# EAGLE design main_v1 (EAGLE 6.5.0)
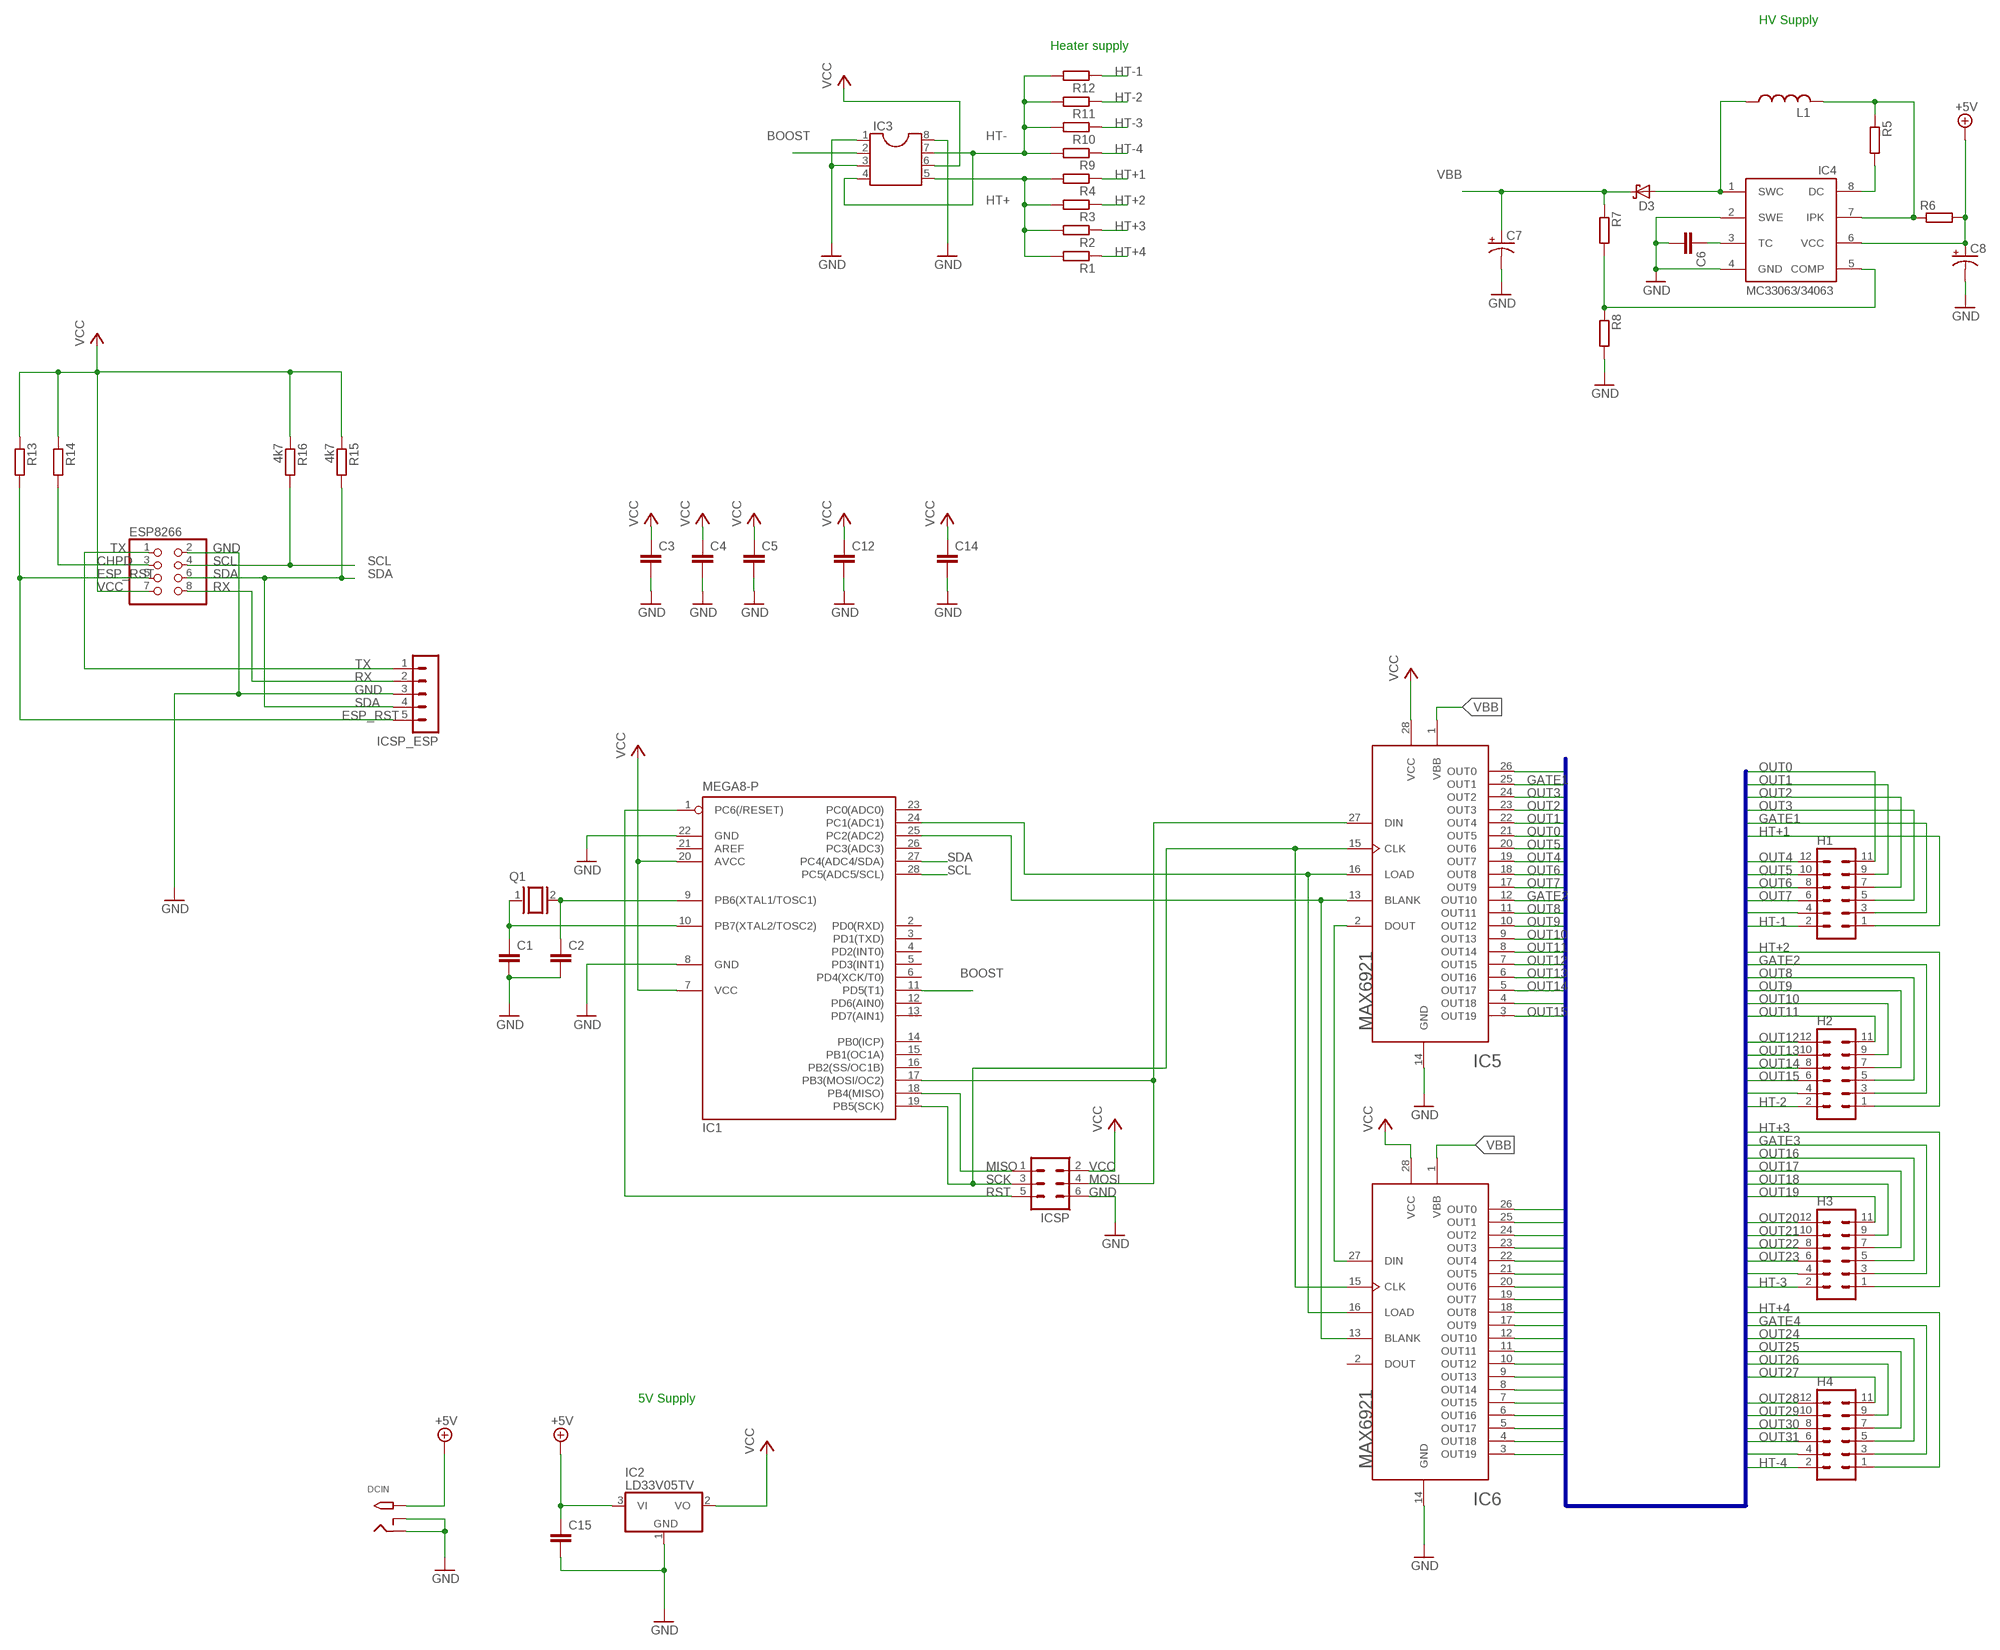
[diagram p0: schematic, sheet 1]

## Parts
C1  C2.5/2  [C2.5-2]
C2  C2.5/2  [C2.5-2]
C3  C-EU025-025X050  [C025-025X050]
C4  C-EU025-025X050  [C025-025X050]
C5  C-EU025-025X050  [C025-025X050]
C6  C-EU025-025X050  [C025-025X050]
C7  CPOL-USE3.5-8  [E3,5-8]
C8  CPOL-USE2.5-5  [E2,5-5]
C12  C-EU025-025X050  [C025-025X050]
C14  C-EU025-025X050  [C025-025X050]
C15  C-EU025-025X050  [C025-025X050]
D3  SCHOTTKY-DIODEDO35-7  [DO35-7]
DCIN  2.1MMJACKTHM  [PJ-102A]
ESP8266  PINHD-2X4  [2X04]
H1  MA06-2  [MA06-2]
H2  MA06-2  [MA06-2]
H3  MA06-2  [MA06-2]
H4  MA06-2  [MA06-2]
IC1  MEGA8-P  [DIL28-3]
IC2  LD33V05TV  [TO220V]
IC3  DIL8  [DIL08]
IC4  MC33063/MC34063P  [DIL08]
IC5  MAX6921  [PLCC-S28]
IC6  MAX6921  [PLCC-S28]
ICSP  MA03-2  [MA03-2]
ICSP_ESP  MA05-1  [MA05-1]
L1  L-US6000-XXX-RC  [6000-XXXX-RC]
Q1  XTAL/S  [QS]
R1  R-EU_0204/7  [0204/7]
R2  R-EU_0204/7  [0204/7]
R3  R-EU_0204/7  [0204/7]
R4  R-EU_0204/7  [0204/7]
R5  R-EU_0204/7  [0204/7]
R6  R-EU_0204/7  [0204/7]
R7  R-EU_0204/7  [0204/7]
R8  R-EU_0204/7  [0204/7]
R9  R-EU_0204/7  [0204/7]
R10  R-EU_0204/7  [0204/7]
R11  R-EU_0204/7  [0204/7]
R12  R-EU_0204/7  [0204/7]
R13  R-EU_0207/10  [0207/10]
R14  R-EU_0204/7  [0204/7]
R15  4k7  R-EU_0204/7  [0204/7]
R16  4k7  R-EU_0204/7  [0204/7]

## Nets
+5V: C8.+ C15.1 DCIN.TIP IC2.3(VI) IC4.6(VCC) R6.2
BOOST: IC1.11(PD5(T1)) IC3.2
CHPD: ESP8266.3 R14.2
ESP_RST: ESP8266.5 ICSP_ESP.5 R13.2
GATE1: H1.3 IC5.25(OUT1)
GATE2: H2.3 IC5.12(OUT10)
GATE3: H3.3 IC6.25(OUT1)
GATE4: H4.3 IC6.12(OUT10)
GND: C1.2 C2.2 C3.2 C4.2 C5.2 C6.2 C7.- C8.- C12.2 C14.2 C15.2 DCIN.RING DCIN.RING_SW ESP8266.2 IC1.8(GND) IC1.22(GND) IC2.1(GND) IC3.1 IC3.3 IC3.8 IC4.2(SWE) IC4.4(GND) IC5.14(GND) IC6.14(GND) ICSP.6 ICSP_ESP.3 R8.2
HT+: IC3.5 R1.2 R2.2 R3.2 R4.2
HT+1: H1.1 R4.1
HT+2: H2.1 R3.1
HT+3: H3.1 R2.1
HT+4: H4.1 R1.1
HT-: IC3.4 IC3.7 R9.2 R10.2 R11.2 R12.2
HT-1: H1.2 R12.1
HT-2: H2.2 R11.1
HT-3: H3.2 R10.1
HT-4: H4.2 R9.1
MISO: IC1.18(PB4(MISO)) ICSP.1
MOSI: IC1.17(PB3(MOSI/OC2)) IC5.27(DIN) ICSP.4
N$1: IC5.2(DOUT) IC6.27(DIN)
N$2: C1.1 IC1.10(PB7(XTAL2/TOSC2)) Q1.1
N$3: IC1.25(PC2(ADC2)) IC5.13(BLANK) IC6.13(BLANK)
N$4: IC1.24(PC1(ADC1)) IC5.16(LOAD) IC6.16(LOAD)
N$5: C6.1 IC4.3(TC)
N$6: C2.1 IC1.9(PB6(XTAL1/TOSC1)) Q1.2
N$7: D3.A IC4.1(SWC) L1.1
N$8: IC4.7(IPK) L1.2 R5.1 R6.1
N$9: IC4.8(DC) R5.2
N$11: IC4.5(COMP) R7.2 R8.1
OUT0: H1.11 IC5.21(OUT5)
OUT1: H1.9 IC5.22(OUT4)
OUT2: H1.7 IC5.23(OUT3)
OUT3: H1.5 IC5.24(OUT2)
OUT4: H1.12 IC5.19(OUT7)
OUT5: H1.10 IC5.20(OUT6)
OUT6: H1.8 IC5.18(OUT8)
OUT7: H1.6 IC5.17(OUT9)
OUT8: H2.5 IC5.11(OUT11)
OUT9: H2.7 IC5.10(OUT12)
OUT10: H2.9 IC5.9(OUT13)
OUT11: H2.11 IC5.8(OUT14)
OUT12: H2.12 IC5.7(OUT15)
OUT13: H2.10 IC5.6(OUT16)
OUT14: H2.8 IC5.5(OUT17)
OUT15: H2.6 IC5.3(OUT19)
OUT16: H3.5 IC6.24(OUT2)
OUT17: H3.7 IC6.23(OUT3)
OUT18: H3.9 IC6.22(OUT4)
OUT19: H3.11 IC6.21(OUT5)
OUT20: H3.12 IC6.19(OUT7)
OUT21: H3.10 IC6.20(OUT6)
OUT22: H3.8 IC6.18(OUT8)
OUT23: H3.6 IC6.17(OUT9)
OUT24: H4.5 IC6.11(OUT11)
OUT25: H4.7 IC6.10(OUT12)
OUT26: H4.9 IC6.9(OUT13)
OUT27: H4.11 IC6.8(OUT14)
OUT28: H4.12 IC6.7(OUT15)
OUT29: H4.10 IC6.6(OUT16)
OUT30: H4.8 IC6.5(OUT17)
OUT31: H4.6 IC6.3(OUT19)
RST: IC1.1(PC6(/RESET)) ICSP.5
RX: ESP8266.8 ICSP_ESP.2
SCK: IC1.19(PB5(SCK)) IC5.15(CLK) IC6.15(CLK) ICSP.3
SCL: ESP8266.4 IC1.28(PC5(ADC5/SCL)) R16.2
SDA: ESP8266.6 IC1.27(PC4(ADC4/SDA)) ICSP_ESP.4 R15.2
SPARE1: H1.4 IC5.26(OUT0)
SPARE2: H2.4 IC5.4(OUT18)
SPARE3: H3.4 IC6.26(OUT0)
SPARE4: H4.4 IC6.4(OUT18)
TX: ESP8266.1 ICSP_ESP.1
VBB: C7.+ D3.C IC5.1(VBB) IC6.1(VBB) R7.1
VCC: C3.1 C4.1 C5.1 C12.1 C14.1 ESP8266.7 IC1.7(VCC) IC1.20(AVCC) IC2.2(VO) IC3.6 IC5.28(VCC) IC6.28(VCC) ICSP.2 R13.1 R14.1 R15.1 R16.1
Unconnected: IC1.2(PD0(RXD)) IC1.3(PD1(TXD)) IC1.4(PD2(INT0)) IC1.5(PD3(INT1)) IC1.6(PD4(XCK/T0)) IC1.12(PD6(AIN0)) IC1.13(PD7(AIN1)) IC1.14(PB0(ICP)) IC1.15(PB1(OC1A)) IC1.16(PB2(SS/OC1B)) IC1.21(AREF) IC1.23(PC0(ADC0)) IC1.26(PC3(ADC3)) IC6.2(DOUT)

## Buses
OUT[0..32],HT+[1..4],HT-[1..4],GATE[1..4],SPARE[1..4]

## Notes on the sheet
- HV Supply
- Heater supply
- 5V Supply

## Library data of the parts
C1 C2 = capacitor-wima:C: CAPACITOR naming: grid - package width
C3-C6 C12 C14 C15 = resistor:C-EU: CAPACITOR, European symbol
C7 C8 = adafruit:CPOL-US: POLARIZED CAPACITOR, American symbol
D3 = adafruit:SCHOTTKY-DIODE: Schottky Diode
DCIN = adafruit:2.1MMJACK: 2.1mm x 5.5mm THM DC jack with internal switch. Digikey part #PJ-102A, 4UCON part #05537 2.1mm x 5.5mm SMT DC jack with internal switch. Digikey part #PJ-002A-SMT, 4UCON part #03267 By microbuilder.eu & adafruit.com
ESP8266 = adafruit:PINHD-2X4: PIN HEADER
H1-H4 = con-lstb:MA06-2: PIN HEADER; OC_FARNELL: unknown; OC_NEWARK: unknown
IC1 = atmel:MEGA8-P: MICROCONTROLLER 8 Kbytes FLASH, 1 kbytes SRAM, 512 bytes EEPROM, USART, 4-channel 10 bit ADC, 2-channel 8 bit ADC Pin compatible with Atmega48, ATMega88, ATMega168 Source: avr.lbr; OC_FARNELL: unknown; OC_NEWARK: unknown
IC2 = ld33v:LD33V: Positive VOLTAGE REGULATOR Source: http://cache.national.com/ds/LM/LM78L05.pdf http://www.fairchildsemi.com/ds/LM/LM7805.pdf
IC3 = ic-package:DIL8: Dual In Line / Socket
IC4 = adafruit:MC33063/MC34063: MC33063 and MC34063 Basic DC/DC converter with internal power-NPN transistor, 100KHz, 1.5A peak switch current. 3-40 input/output.
IC5 IC6 = adafruit:MAX6921: MAX6921 76V VFD driver in TSSOP and PLCC. Can be cascaded, talk to it via SPI
ICSP = con-lstb:MA03-2: PIN HEADER; OC_FARNELL: unknown; OC_NEWARK: unknown
ICSP_ESP = con-lstb:MA05-1: PIN HEADER; OC_FARNELL: unknown; OC_NEWARK: unknown
L1 = rcl:L-US: INDUCTOR, American symbol
Q1 = special:XTAL/S: CRYSTAL
R1-R16 = resistor:R-EU_: RESISTOR, European symbol

## Board
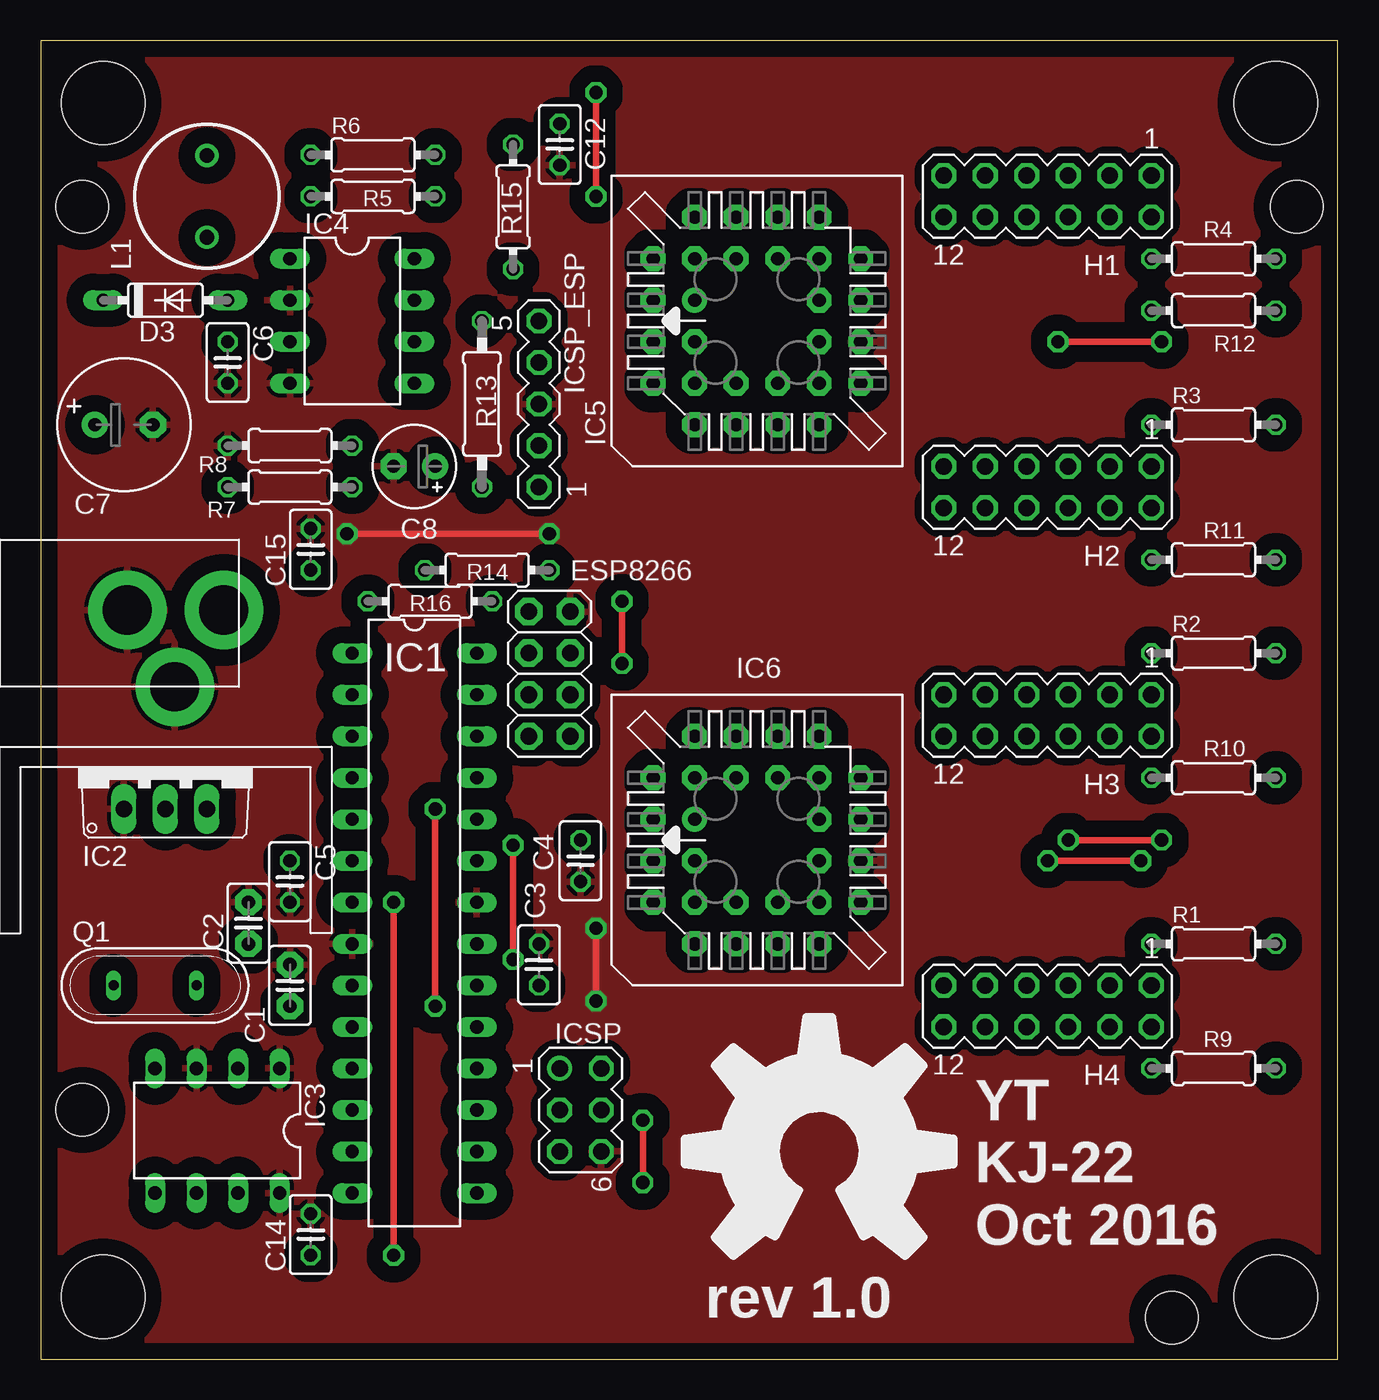
[diagram p1: board, top side]
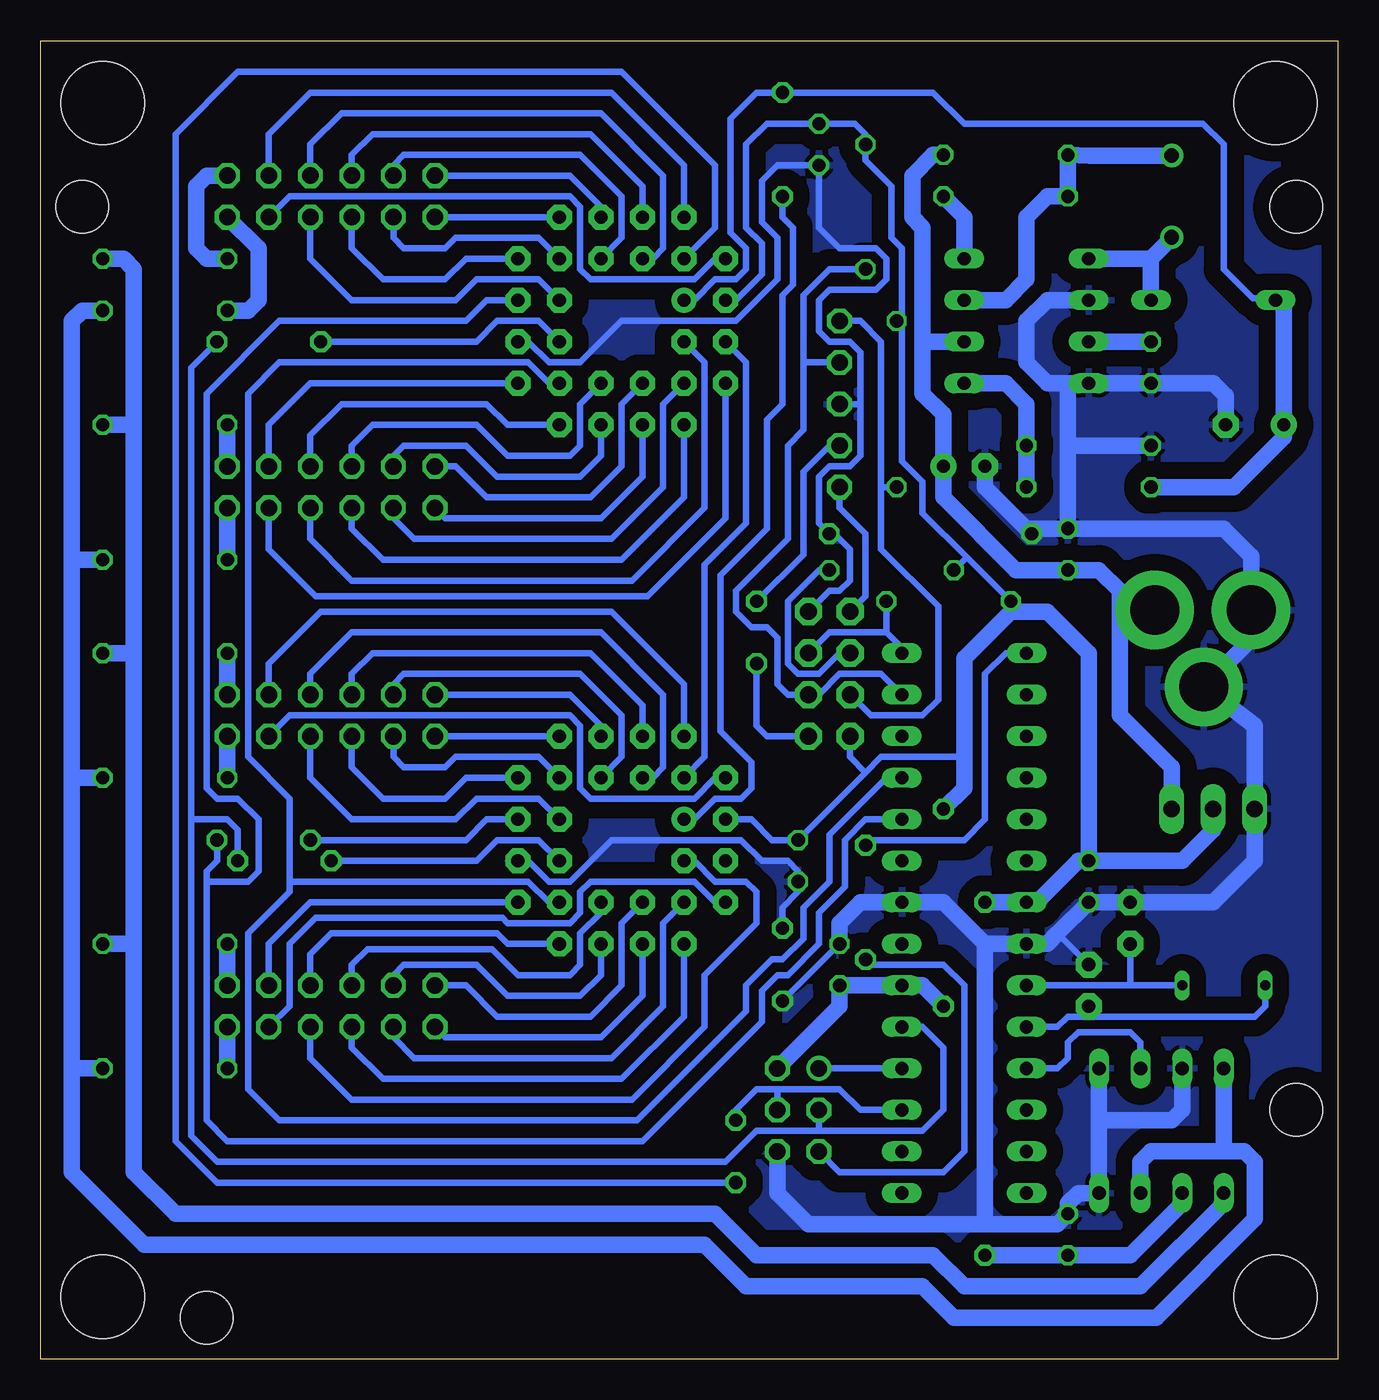
[diagram p2: board, bottom side, seen from below]

Size 79.35 x 80.63 mm. Coordinates in mm from the lower left corner, seen from the top.
Outline: 0,0 79.35,0 79.35,80.63 0,80.63 0,0
Copper layers (1*16): Top 0.035559375mm / dielectric 1.6mm / Bottom 0.035559375mm
Design rules "oshpark dru": minimum track width 6mil, minimum drill 10mil, track to track 6mil, track to pad 6mil, pad to pad 6mil, via to via 6mil, smd to smd 6mil, copper to edge 15mil, drill to drill 6mil, minimum pad ring 5mil, minimum via ring 5mil, stop-mask expansion 2.5mil, vias tented up to drill 0mil, thermal gap 10mil
Holes 5.08 mm at 3.81,76.83 3.81,3.81 75.56,3.81 75.56,76.83
Holes 3.2 mm at 2.54,70.48 2.54,15.24 69.21,2.54 76.83,70.48

### Footprints (pad centres in the part's own frame; a part is rotated, then mirrored left to right if it is on the bottom)
C2.5-2 = drill 0.813 pad 1.6 octagon: 1 -1.27,0; 2 1.27,0
C025-025X050 = drill 0.813 octagon: 1 -1.27,0; 2 1.27,0
E3,5-8 = drill 0.813 pad 1.6: + -1.778,0 | drill 0.813 pad 1.6 octagon: - 1.778,0
E2,5-5 = drill 0.813 pad 1.6: + -1.27,0 | drill 0.813 pad 1.6 octagon: - 1.27,0
DO35-7 = drill 0.813 long: A 3.81,0; C -3.81,0
PJ-102A = drill 3 pad 4.8: RING 0.1,-3.39; RING_SW -4.6,-6.29; TIP 0.1,-9.29
2X04 = drill 1.016 pad 1.676 octagon: 1 -3.81,-1.27; 2 -3.81,1.27; 3 -1.27,-1.27; 4 -1.27,1.27; 5 1.27,-1.27; 6 1.27,1.27; 7 3.81,-1.27; 8 3.81,1.27
MA06-2 = drill 1.016 octagon: 1 -6.35,-1.27; 2 -6.35,1.27; 3 -3.81,-1.27; 4 -3.81,1.27; 5 -1.27,-1.27; 6 -1.27,1.27; 7 1.27,-1.27; 8 1.27,1.27; 9 3.81,-1.27; 10 3.81,1.27; 11 6.35,-1.27; 12 6.35,1.27
DIL28-3 = drill 0.813 long: 1 -16.51,-3.81; 2 -13.97,-3.81; 3 -11.43,-3.81; 4 -8.89,-3.81; 5 -6.35,-3.81; 6 -3.81,-3.81; 7 -1.27,-3.81; 8 1.27,-3.81; 9 3.81,-3.81; 10 6.35,-3.81; 11 8.89,-3.81; 12 11.43,-3.81; 13 13.97,-3.81; 14 16.51,-3.81; 15 16.51,3.81; 16 13.97,3.81; 17 11.43,3.81; 18 8.89,3.81; 19 6.35,3.81; 20 3.81,3.81; 21 1.27,3.81; 22 -1.27,3.81; 23 -3.81,3.81; 24 -6.35,3.81; 25 -8.89,3.81; 26 -11.43,3.81; 27 -13.97,3.81; 28 -16.51,3.81
TO220V = drill 1.016 long: 1 -2.54,-2.54; 2 0,-2.54; 3 2.54,-2.54
DIL08 = drill 0.813 long: 1 -3.81,-3.81; 2 -1.27,-3.81; 3 1.27,-3.81; 4 3.81,-3.81; 5 3.81,3.81; 6 1.27,3.81; 7 -1.27,3.81; 8 -3.81,3.81
PLCC-S28 = drill 0.813 pad 1.524: 1 1.27,3.81 | drill 0.813 pad 1.524 octagon: 2 -1.27,6.35; 3 -1.27,3.81; 4 -3.81,6.35; 5 -6.35,3.81; 6 -3.81,3.81; 7 -6.35,1.27; 8 -3.81,1.27; 9 -6.35,-1.27; 10 -3.81,-1.27; 11 -6.35,-3.81; 12 -3.81,-6.35; 13 -3.81,-3.81; 14 -1.27,-6.35; 15 -1.27,-3.81; 16 1.27,-6.35; 17 1.27,-3.81; 18 3.81,-6.35; 19 6.35,-3.81; 20 3.81,-3.81; 21 6.35,-1.27; 22 3.81,-1.27; 23 6.35,1.27; 24 3.81,1.27; 25 6.35,3.81; 26 3.81,6.35; 27 3.81,3.81; 28 1.27,6.35
MA03-2 = drill 1.016: 1 -2.54,-1.27 | drill 1.016 octagon: 2 -2.54,1.27; 3 0,-1.27; 4 0,1.27; 5 2.54,-1.27; 6 2.54,1.27
MA05-1 = drill 1.016 octagon: 1 -5.08,0; 2 -2.54,0; 3 0,0; 4 2.54,0; 5 5.08,0
6000-XXXX-RC = drill 0.9 pad 1.422: 1 -2.5,0; 2 2.5,0
QS = drill 0.61 long: 1 -2.54,0; 2 2.54,0
0204/7 = drill 0.813 octagon: 1 -3.81,0; 2 3.81,0
0207/10 = drill 0.813 octagon: 1 -5.08,0; 2 5.08,0

### Placement (x,y rotation side)
C1  15.24,22.86 90 top
C2  12.7,26.67 90 top
C3  30.48,24.13 90 top
C4  33.02,30.48 270 top
C5  15.24,29.21 270 top
C6  11.43,60.96 270 top
C7  5.08,57.15 0 top
C8  22.86,54.61 180 top
C12  31.75,74.3 270 top
C14  16.51,7.62 90 top
C15  16.51,49.53 90 top
D3  7.62,64.77 0 top
DCIN  1.91,45.72 90 top
ESP8266  31.12,41.91 270 top
H1  61.6,71.12 180 top
H2  61.6,53.34 180 top
H3  61.6,39.37 180 top
H4  61.6,21.59 180 top
IC1  22.86,26.67 270 top
IC2  7.62,36.2 0 top
IC3  10.8,13.97 180 top
IC4  19.05,63.5 270 top
IC5  43.81,63.5 90 top
IC6  43.81,31.75 90 top
ICSP  33.02,15.24 270 top
ICSP_ESP  30.48,58.42 90 top
L1  10.16,71.12 90 top
Q1  6.99,22.86 0 top
R1  71.75,25.4 0 top
R2  71.75,43.18 0 top
R3  71.75,57.15 0 top
R4  71.75,67.31 0 top
R5  20.32,71.12 0 top
R6  20.32,73.66 0 top
R7  15.24,53.34 0 top
R8  15.24,55.88 180 top
R9  71.75,17.78 0 top
R10  71.75,35.56 0 top
R11  71.75,48.9 0 top
R12  71.75,64.14 0 top
R13  26.99,58.42 270 top
R14  27.3,48.26 0 top
R15  28.89,70.48 270 top
R16  23.81,46.35 0 top

### Tracks (layer width: path | path; a pad name or v marks a point on that pad's centre or on a via)
+5V
  Bottom 1.016: R6.2 24.77,73.66 26.04,72.39 26.04,69.85 25.4,69.22 25.4,62.23 | 25.4,62.23 IC4.6 | 25.4,62.23 25.4,59.05 24.13,57.78 C8.+ 24.13,52.7 19.69,48.26 C15.1 14.61,48.26 13.34,46.99 13.34,45.72 | 13.34,45.72 13.34,39.37 10.16,36.2 IC2.3 | DCIN.TIP 13.23,45.82 13.34,45.72
BOOST
  Bottom 0.406: IC1.11 17.14,17.78 16.51,18.41 16.51,19.37 15.88,20 12.7,20 12.07,19.37 IC3.2
CHPD
  Bottom 0.406: ESP8266.3 30.48,43.18 31.75,41.91 33.02,41.91 33.66,42.55 33.66,46.35 31.75,48.26 R14.2
ESP_RST
  Bottom 0.406: ESP8266.5 28.57,39.37 25.4,39.37 24.45,40.32 24.45,46.04 27.94,49.53 27.94,53.34 | ICSP_ESP.5 29.21,63.5 27.94,62.23 27.94,53.34 | R13.2 27.94,53.34
GATE1
  Bottom 0.406: IC5.25 40.01,73.03 44.45,77.47 62.87,77.47 65.4,74.93 H1.3
GATE2
  Bottom 0.406: IC5.12 62.87,59.69 65.4,57.15 H2.3
GATE3
  Bottom 0.406: H3.3 65.4,42.55 62.23,45.72 44.45,45.72 40.01,41.27 IC6.25
GATE4
  Bottom 0.406: IC6.12 62.87,27.94 65.4,25.4 H4.3
GND  (via drill 0.81 pad 1.27)
  Top 0.406: v33.97,26.35 v33.97,21.91 | v18.73,50.48 v31.12,50.48
  Bottom 0.406: IC5.14 49.53,62.23 48.26,60.96 46.36,60.96 43.81,63.5 36.83,63.5 34.29,66.04 34.29,68.58 35.24,69.53 35.24,72.07 34.29,73.03 C12.2 31.75,69.22 30.48,67.94 28.26,67.94 27.62,67.31 27.62,66.04 28.26,65.41 31.12,65.41 31.75,64.77 31.75,62.87 31.12,62.23 29.84,62.23 29.21,61.59 29.21,58.42 | IC6.14 49.53,30.48 48.26,29.21 46.99,29.21 44.45,31.75 36.51,31.75 35.24,30.48 33.66,30.48 33.02,29.84 C4.2 33.02,28.57 33.97,27.62 v33.97,26.35 | C1.2 17.14,26.04 | C3.2 v33.97,21.91 | ESP8266.2 31.12,46.99 30.48,46.99 29.84,47.62 29.84,49.53 30.8,50.48 v31.12,50.48 31.75,51.12 31.75,53.98 31.12,54.61 29.84,54.61 29.21,55.24 29.21,58.42 | ICSP_ESP.3 29.21,58.42
  Bottom 1.016: 16.51,59.69 IC4.4 C6.2 7.62,59.69 6.86,58.93 C7.- | IC4.2 17.78,64.77 19.05,63.5 19.05,60.96 17.78,59.69 16.51,59.69 | 16.51,59.69 16.51,55.88 | C8.- 21.59,53.34 19.05,50.8 18.73,50.8 | R8.2 16.51,55.88 | 16.51,55.88 C15.2 | C15.2 18.73,50.8 | C15.2 6.99,50.8 5.29,49.11 DCIN.RING 5.29,44.02 DCIN.RING_SW 5.08,38.73 IC2.1 5.08,30.48 7.62,27.94 C2.2 C5.2 17.14,26.04 17.78,25.4 IC1.8 21.59,25.4 | C3.2 30.48,26.67 29.21,27.94 IC1.22 24.13,27.94 21.59,25.4 | ICSP.6 34.29,10.16 32.38,8.26 21.59,8.26 | 21.59,8.26 21.59,25.4 | 21.59,8.26 17.14,8.26 C14.2 16.51,9.53 15.88,10.16 IC3.8 14.61,14.61 | 14.61,14.61 10.16,14.61 9.52,15.24 IC3.3 | IC3.1 14.61,14.61 | v18.73,50.48 18.73,50.8
  pour Bottom (isolate 1.016): 0.63,0.64 78.74,0.64 78.74,80.01 0.63,80.01
  pour Top (isolate 1.016): 0.63,80.01 78.74,80.01 78.74,0.64 0.63,0.64
HT+
  Bottom 1.016: IC3.5 6.99,9.53 12.07,4.45 22.86,4.45 24.77,6.35 35.56,6.35 38.1,8.89 71.12,8.89 73.66,11.43 73.66,25.4 | 73.66,25.4 73.66,43.18 | 73.66,43.18 73.66,57.15 | 73.66,57.15 73.66,66.67 74.29,67.31 R4.2 | R3.2 73.66,57.15 | R2.2 73.66,43.18 | R1.2 73.66,25.4
HT+1
  Bottom 1.016: R4.1 69.21,67.31 69.85,67.94 69.85,71.75 69.21,72.39 H1.1
HT+2
  Bottom 1.016: H2.1 R3.1
HT+3
  Bottom 1.016: H3.1 R2.1
HT+4
  Bottom 1.016: R1.1 H4.1
HT-
  Bottom 1.016: IC3.4 6.99,12.7 | 6.99,12.7 11.43,12.7 12.07,12.06 IC3.7 | 6.99,12.7 5.72,12.7 5.08,12.06 5.08,8.57 11.11,2.54 23.5,2.54 25.4,4.45 36.2,4.45 38.73,6.99 73.02,6.99 77.47,11.43 77.47,17.78 | 77.47,17.78 77.47,35.56 | 77.47,35.56 77.47,48.9 | 77.47,48.9 77.47,63.5 76.83,64.14 R12.2 | R11.2 77.47,48.9 | R10.2 77.47,35.56 | R9.2 77.47,17.78
HT-1
  Bottom 1.016: H1.2 66.04,67.94 66.04,64.77 66.67,64.14 R12.1
HT-2
  Bottom 1.016: H2.2 R11.1
HT-3
  Bottom 1.016: R10.1 H3.2
HT-4
  Bottom 1.016: R9.1 H4.2
MISO
  Bottom 0.406: ICSP.1 IC1.18
MOSI  (via drill 0.81 pad 1.27)
  Top 0.406: v36.83,10.79 v36.83,14.61
  Bottom 0.406: ICSP.4 34.29,16.51 | 34.29,16.51 30.48,16.51 29.21,15.24 IC1.17 | 34.29,16.51 35.56,16.51 36.83,15.24 v36.83,14.61 | IC5.27 38.1,69.22 38.1,73.03 43.81,78.74 67.31,78.74 71.12,74.93 71.12,13.34 68.58,10.79 v36.83,10.79
N$1
  Bottom 0.406: IC5.2 36.2,60.96 36.2,51.12 38.73,48.58 38.73,36.83 IC6.27
N$2
  Bottom 0.406: Q1.1 4.45,21.59 5.08,20.95 15.24,20.95 | 15.24,20.95 16.51,20.95 17.14,20.32 IC1.10 | C1.1 15.24,20.95
N$3
  Bottom 0.406: IC6.13 48.26,27.94 49.53,29.21 64.13,29.21 | 64.13,29.21 64.13,28.57 66.67,26.04 66.67,16.51 64.77,14.61 42.86,14.61 36.2,21.27 36.2,22.86 34.61,24.45 33.97,24.45 32.7,25.72 32.7,27.62 31.12,29.21 31.12,32.07 27.62,35.56 IC1.25 | IC5.13 48.26,59.69 49.53,60.96 64.77,60.96 66.67,59.05 66.67,36.83 64.13,34.29 64.13,29.21
N$4  (via drill 0.81 pad 1.27)
  Top 0.406: v62.87,31.75 v68.58,31.75
  Bottom 0.406: IC1.24 28.89,33.02 30.16,31.75 30.16,28.89 31.75,27.3 31.75,25.4 33.66,23.5 34.29,23.5 35.24,22.54 35.24,20.64 42.55,13.34 67.94,13.34 69.21,14.61 69.21,29.21 | v62.87,31.75 53.34,31.75 52.07,33.02 IC6.16 | IC5.16 52.07,64.77 53.34,63.5 64.77,63.5 69.21,59.05 69.21,34.92 68.58,34.29 67.31,34.29 66.04,33.02 66.04,29.84 66.67,29.21 69.21,29.21 | 69.21,29.21 69.21,29.84 68.58,30.48 v68.58,31.75
N$5
  Bottom 1.016: C6.1 IC4.3
N$6
  Bottom 0.406: Q1.2 12.7,22.86 | C2.1 12.7,22.86 | 12.7,22.86 IC1.9
N$7
  Bottom 0.406: 10.2,68.58 L1.1
  Bottom 1.016: D3.A 11.43,67.31 | 11.43,67.31 10.16,68.58 10.2,68.58 | 11.43,67.31 IC4.1
N$8
  Bottom 1.016: L1.2 15.2,73.62 R6.1 R5.1 17.78,71.12 19.05,69.85 19.05,66.04 20.32,64.77 IC4.7
N$9
  Bottom 1.016: R5.2 22.86,69.85 IC4.8
N$11
  Bottom 1.016: R7.2 R8.1 19.05,58.42 20.32,59.69 IC4.5
OUT0
  Bottom 0.406: IC5.21 45.09,70.48 46.99,72.39 H1.11
OUT1
  Bottom 0.406: H1.9 57.79,73.03 57.15,73.66 46.36,73.66 43.81,71.12 43.81,68.58 IC5.22
OUT2
  Bottom 0.406: IC5.23 42.55,71.75 45.72,74.93 59.05,74.93 60.33,73.66 H1.7
OUT3
  Bottom 0.406: H1.5 62.87,74.3 60.96,76.2 45.09,76.2 41.27,72.39 41.27,67.94 41.91,67.31 IC5.24
OUT4
  Bottom 0.406: IC5.19 H1.12
OUT5
  Bottom 0.406: H1.10 57.79,68.58 57.15,67.94 54.61,67.94 53.98,68.58 48.9,68.58 IC5.20
OUT6
  Bottom 0.406: IC5.18 53.34,67.31 54.61,66.04 58.42,66.04 60.33,67.94 H1.8
OUT7
  Bottom 0.406: IC5.17 48.9,66.04 52.7,66.04 53.98,64.77 60.33,64.77 62.87,67.31 H1.6
OUT8
  Bottom 0.406: IC5.11 50.8,57.15 52.07,58.42 60.96,58.42 62.87,56.52 H2.5
OUT9
  Bottom 0.406: IC5.10 46.36,58.42 46.36,55.88 46.99,55.24 50.8,55.24 52.7,57.15 59.05,57.15 60.33,55.88 H2.7
OUT10
  Bottom 0.406: IC5.9 45.09,55.24 46.36,53.98 51.44,53.98 53.34,55.88 57.15,55.88 57.79,55.24 H2.9
OUT11
  Bottom 0.406: IC5.8 43.81,58.42 43.81,54.61 45.72,52.7 52.07,52.7 53.98,54.61 H2.11
OUT12
  Bottom 0.406: IC5.7 42.55,53.98 45.09,51.44 54.61,51.44 H2.12
OUT13
  Bottom 0.406: IC5.6 41.27,58.42 41.27,53.34 44.45,50.16 56.52,50.16 57.79,51.44 H2.10
OUT14
  Bottom 0.406: IC5.5 40.01,52.7 43.81,48.9 58.42,48.9 60.33,50.8 H2.8
OUT15
  Bottom 0.406: IC5.3 38.73,60.96 38.73,52.07 43.18,47.62 60.33,47.62 62.87,50.16 H2.6
OUT16
  Bottom 0.406: H3.5 62.87,41.91 60.33,44.45 45.09,44.45 41.27,40.64 41.27,36.2 41.91,35.56 IC6.24
OUT17
  Bottom 0.406: H3.7 60.33,41.91 59.05,43.18 45.72,43.18 42.55,40.01 IC6.23
OUT18
  Bottom 0.406: H3.9 57.79,41.27 57.15,41.91 46.36,41.91 43.81,39.37 43.81,36.83 IC6.22
OUT19
  Bottom 0.406: H3.11 46.99,40.64 45.09,38.73 IC6.21
OUT20
  Bottom 0.406: H3.12 IC6.19
OUT21
  Bottom 0.406: H3.10 57.79,36.83 57.15,36.2 54.61,36.2 53.98,36.83 48.9,36.83 IC6.20
OUT22
  Bottom 0.406: IC6.18 53.34,35.56 54.61,34.29 58.42,34.29 60.33,36.2 H3.8
OUT23
  Bottom 0.406: IC6.17 48.9,34.29 52.7,34.29 53.98,33.02 60.33,33.02 62.87,35.56 H3.6
OUT24
  Bottom 0.406: IC6.11 50.8,25.4 51.44,26.04 61.6,26.04 62.87,24.77 H4.5
OUT25
  Bottom 0.406: IC6.10 45.09,27.3 46.36,26.04 46.36,24.13 46.99,23.5 50.16,23.5 51.75,25.08 59.37,25.08 60.33,24.13 H4.7
OUT26
  Bottom 0.406: IC6.9 45.09,23.5 46.36,22.23 50.8,22.23 52.7,24.13 57.15,24.13 57.79,23.5 H4.9
OUT27
  Bottom 0.406: IC6.8 43.81,26.67 43.81,22.86 45.72,20.95 51.44,20.95 53.34,22.86 H4.11
OUT28
  Bottom 0.406: IC6.7 42.55,22.23 45.09,19.68 54.61,19.68 H4.12
OUT29
  Bottom 0.406: IC6.6 41.27,26.67 41.27,21.59 44.45,18.41 56.52,18.41 57.79,19.68 H4.10
OUT30
  Bottom 0.406: IC6.5 40.01,20.95 43.81,17.14 58.42,17.14 60.33,19.05 H4.8
OUT31
  Bottom 0.406: IC6.3 39.37,30.48 38.1,29.21 36.2,29.21 35.56,28.57 35.56,26.67 38.73,23.5 38.73,20.32 43.18,15.88 60.33,15.88 62.87,18.41 H4.6
RST  (via drill 0.81 pad 1.27)
  Top 0.406: v28.89,31.43 v28.89,24.45
  Bottom 0.406: ICSP.5 30.48,11.43 24.13,11.43 22.86,12.7 22.86,22.86 24.13,24.13 28.57,24.13 v28.89,24.45 | v28.89,31.43 28.57,31.75 22.86,31.75 21.59,33.02 21.59,41.91 20.32,43.18 IC1.1
RX  (via drill 0.81 pad 1.27)
  Top 0.406: v35.56,42.55 v35.56,46.35
  Bottom 0.406: ESP8266.8 34.93,38.1 35.56,38.73 v35.56,42.55 | ICSP_ESP.2 31.12,55.88 32.7,54.29 32.7,49.21 v35.56,46.35
SCK  (via drill 0.81 pad 1.27)
  Top 0.406: v61.6,30.48 v67.31,30.48 | v62.23,62.23 v68.58,62.23
  Bottom 0.406: 31.75,13.97 25.4,13.97 24.13,15.24 24.13,19.05 25.4,20.32 IC1.19 | ICSP.3 31.75,13.97 | 31.75,13.97 35.56,13.97 37.47,12.06 68.58,12.06 70.17,13.65 70.17,33.02 | v67.31,30.48 67.31,32.38 67.94,33.02 70.17,33.02 | IC6.15 48.9,31.75 51.44,31.75 52.7,30.48 v61.6,30.48 | IC5.15 48.9,63.5 51.44,63.5 52.7,62.23 v62.23,62.23 | v68.58,62.23 70.17,60.64 70.17,33.02
SCL
  Bottom 0.406: 27.62,44.45 26.67,43.5 IC1.28 | ESP8266.4 31.12,44.45 27.62,44.45 | R16.2 27.62,44.45
SDA
  Bottom 0.406: IC1.27 27.94,41.91 30.48,41.91 31.75,40.64 ESP8266.6 33.66,40.64 34.29,41.27 34.29,44.13 34.93,44.77 35.88,44.77 36.83,45.72 36.83,46.99 33.66,50.16 33.66,55.88 32.7,56.83 32.7,60.96 | ICSP_ESP.4 32.7,60.96 | 32.7,60.96 32.7,65.09 31.12,66.67 R15.2
SPARE1
  Bottom 0.406: H1.4 64.13,71.12 46.99,71.12 46.36,70.48 46.36,66.67 45.72,66.04 39.37,66.04 38.1,67.31 IC5.26
SPARE2
  Bottom 0.406: IC5.4 37.47,51.44 42.23,46.67 62.55,46.67 65.4,49.53 H2.4
SPARE3
  Bottom 0.406: IC6.26 38.1,35.56 39.37,34.29 45.72,34.29 46.36,34.92 46.36,38.73 46.99,39.37 64.13,39.37 H3.4
SPARE4
  Bottom 0.406: H4.4 64.13,21.59 64.13,25.4 62.55,26.99 51.12,26.99 50.8,26.67 46.99,26.67 46.36,27.3 46.36,28.57 45.72,29.21 39.37,29.21 38.1,27.94 IC6.4
TX
  Bottom 0.406: ESP8266.1 28.89,46.67 28.89,50.48 30.48,52.07 ICSP_ESP.1
VBB  (via drill 0.81 pad 1.27)
  Top 0.406: v33.97,71.12 v33.97,77.47
  Bottom 0.406: IC6.1 39.37,33.02 38.1,34.29 36.51,34.29 35.88,34.92 35.88,36.51 37.78,38.42 37.78,47.94 34.93,50.8 34.93,57.47 33.97,58.42 33.97,65.09 33.34,65.72 33.34,69.22 33.97,69.85 v33.97,71.12 | IC5.1 39.37,64.77 38.1,66.04 36.83,66.04 36.2,66.67 36.2,67.94 37.15,68.9 37.15,75.88 35.56,77.47 v33.97,77.47 24.77,77.47 22.86,75.56 8.25,75.56 6.99,74.3 6.99,66.67 5.21,64.9 3.17,64.9 3.3,64.77
  Bottom 1.016: R7.1 6.35,53.34 3.3,56.39 C7.+ 3.3,64.77 D3.C
VCC  (via drill 0.81 pad 1.27)
  Top 0.406: v24.13,33.66 v24.13,21.59 | v21.59,6.35 v21.59,27.94
  Bottom 0.406: IC6.28 35.88,33.02 34.61,31.75 C4.1 28.89,35.88 | 26.67,63.5 26.67,67.94 27.3,68.58 27.3,71.75 28.89,73.34 R15.1 28.89,74.93 29.53,75.56 C12.1 34.93,75.56 36.2,74.3 36.2,69.22 35.24,68.26 35.24,66.36 36.83,64.77 IC5.28 | 26.67,63.5 26.67,54.93 25.4,53.66 25.4,51.75 22.7,49.05 | 28.89,35.88 27.94,36.83 22.86,36.83 | 22.7,49.05 R16.1 20,45.72 | R14.1 22.7,49.05 | ESP8266.7 29.84,36.83 28.89,35.88 | R13.1 26.67,63.5
  Bottom 1.016: C5.1 9.52,30.48 7.62,32.38 IC2.2 | C3.1 IC1.20 | ICSP.2 30.48,21.59 C3.1 | C5.1 15.88,30.48 18.41,27.94 IC1.7 v21.59,27.94 | C5.1 15.24,43.18 17.78,45.72 20,45.72 22.86,42.86 22.86,36.83 22.86,34.92 v24.13,33.66 | C3.1 25.4,22.86 v24.13,21.59 | IC3.6 9.52,9.53 12.7,6.35 C14.1 v21.59,6.35

### Text on the board
tPlace: YT / KJ-22 / Oct 2016 | rev 1.0